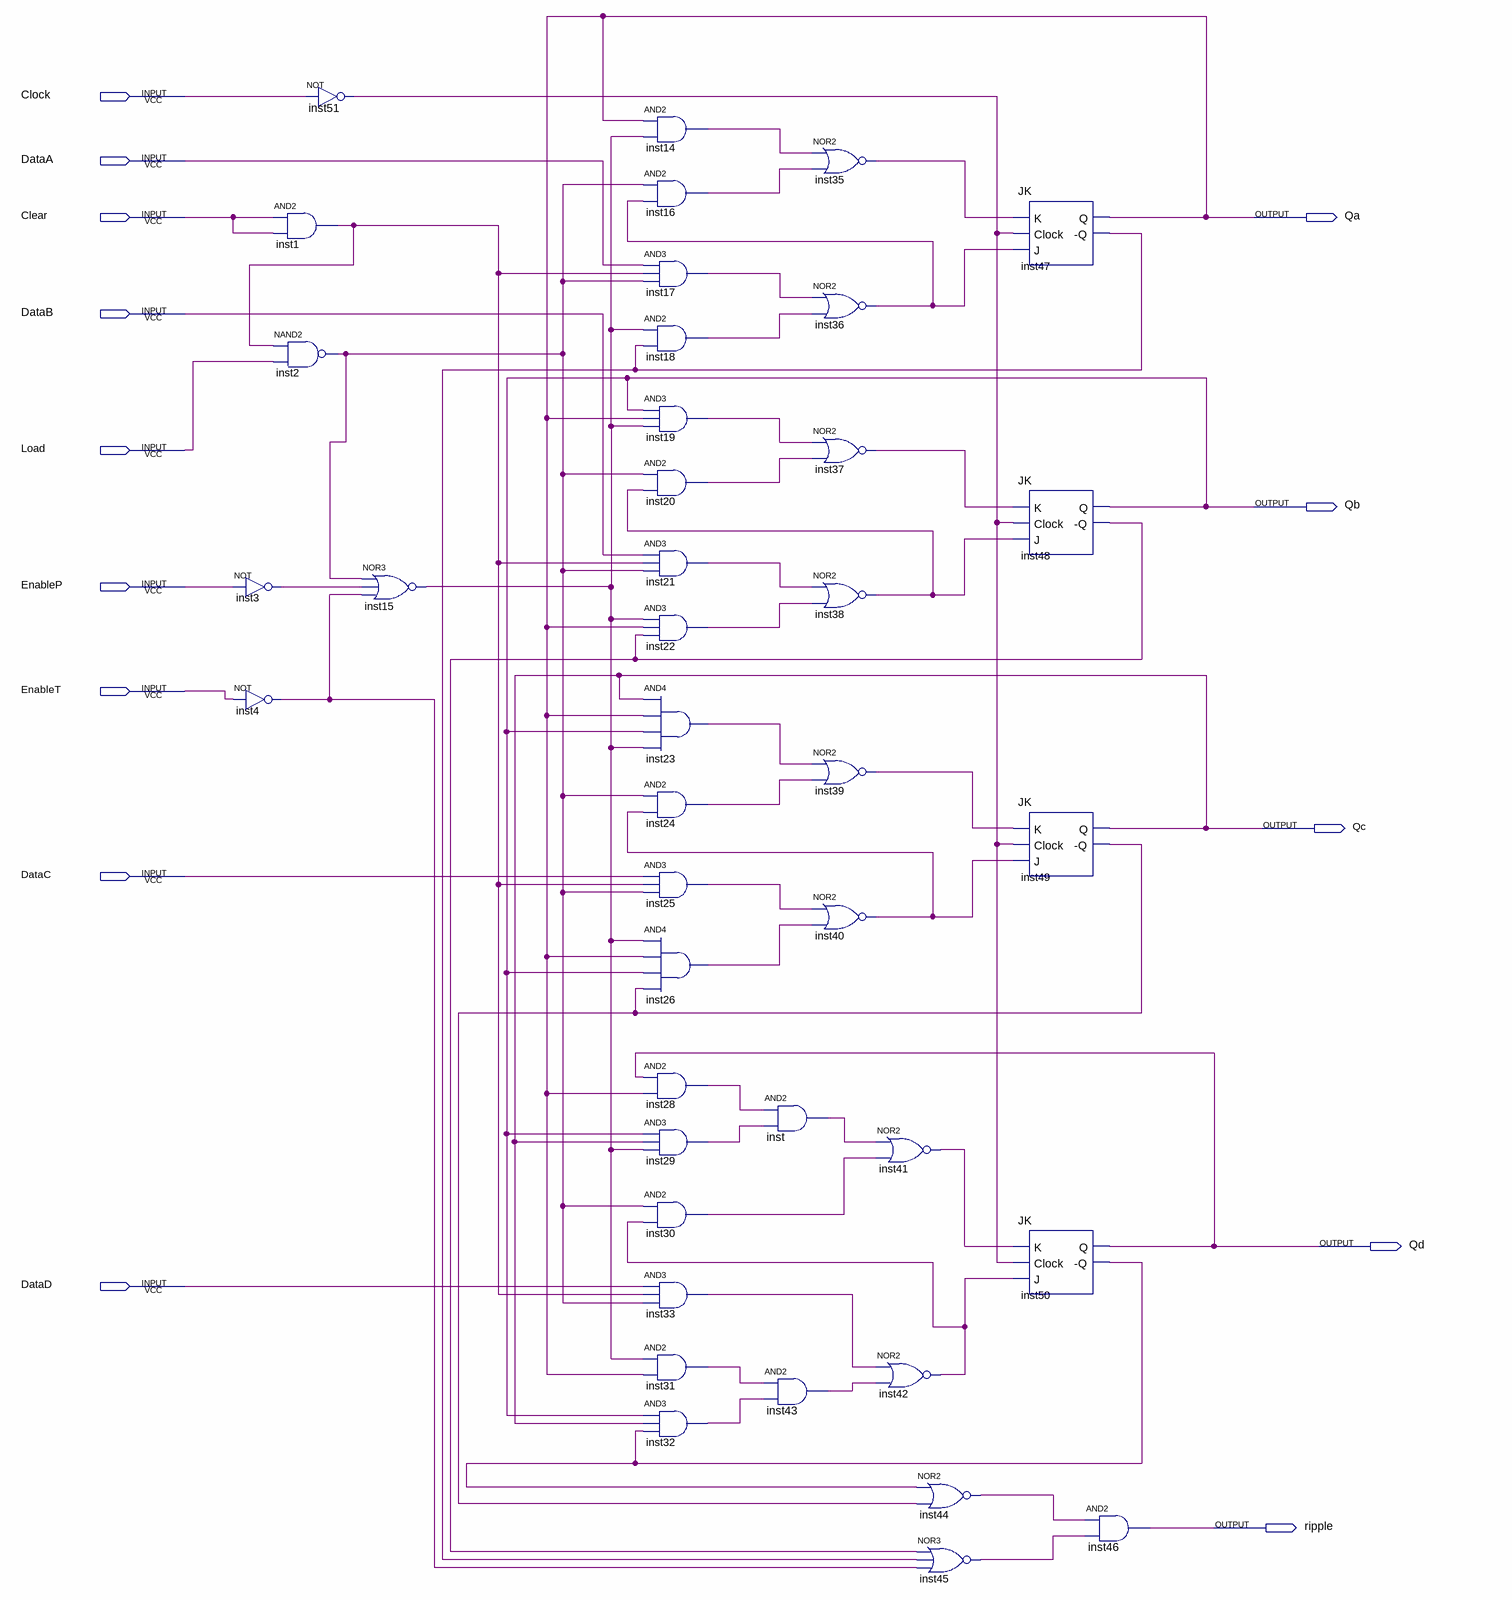
[diagram p0: schematic sheet]
// Quartus schematic 74LS161.bdf as structural Verilog: 41 symbols, 14 pins
module \74LS161  (
  input  Clock,
  input  DataA,
  input  Clear,
  input  DataB,
  input  Load,
  input  EnableP,
  input  EnableT,
  input  DataC,
  input  DataD,
  output Qa,
  output Qb,
  output Qc,
  output Qd,
  output ripple
);

  wire inst1_out, inst2_out, inst3_out, inst4_out, inst14_out, inst15_out, inst16_out, inst17_out,
       inst18_out, inst19_out, inst20_out, inst21_out, inst22_out, inst23_out, inst24_out, inst25_out,
       inst26_out, inst28_out, inst29_out, inst30_out, inst31_out, inst32_out, inst33_out, inst35_out,
       inst36_out, inst37_out, inst38_out, inst39_out, inst40_out, inst41_out, inst42_out, inst43_out,
       inst44_out, inst45_out, inst47__q, inst48__q, inst49__q, inst50__q, inst51_out, inst_out;

  and inst1 (inst1_out, Clear, Clear);
  nand inst2 (inst2_out, inst1_out, Load);
  not inst3 (inst3_out, EnableP);
  not inst4 (inst4_out, EnableT);
  not inst51 (inst51_out, Clock);
  nor inst15 (inst15_out, inst2_out, inst3_out, inst4_out);
  and inst14 (inst14_out, Qa, inst15_out);
  and inst16 (inst16_out, inst2_out, inst36_out);
  and inst17 (inst17_out, DataA, inst1_out, inst2_out);
  and inst18 (inst18_out, inst15_out, inst47__q);
  and inst19 (inst19_out, Qb, Qa, inst15_out);
  and inst20 (inst20_out, inst2_out, inst38_out);
  and inst21 (inst21_out, DataB, inst1_out, inst2_out);
  and inst22 (inst22_out, inst15_out, Qa, inst48__q);
  and inst23 (inst23_out, Qc, Qa, Qb, inst15_out);
  and inst24 (inst24_out, inst2_out, inst40_out);
  and inst25 (inst25_out, DataC, inst1_out, inst2_out);
  and inst26 (inst26_out, inst15_out, Qa, Qb, inst49__q);
  and inst28 (inst28_out, Qd, Qa);
  and inst29 (inst29_out, Qb, Qc, inst15_out);
  and inst30 (inst30_out, inst2_out, inst42_out);
  and inst33 (inst33_out, DataD, inst1_out, inst2_out);
  and inst31 (inst31_out, inst15_out, Qa);
  and inst32 (inst32_out, Qb, Qc, inst50__q);
  and inst (inst_out, inst28_out, inst29_out);
  and inst43 (inst43_out, inst31_out, inst32_out);
  nor inst35 (inst35_out, inst14_out, inst16_out);
  nor inst36 (inst36_out, inst17_out, inst18_out);
  nor inst37 (inst37_out, inst19_out, inst20_out);
  nor inst38 (inst38_out, inst21_out, inst22_out);
  nor inst39 (inst39_out, inst23_out, inst24_out);
  nor inst40 (inst40_out, inst25_out, inst26_out);
  nor inst41 (inst41_out, inst_out, inst30_out);
  nor inst42 (inst42_out, inst33_out, inst43_out);
  nor inst44 (inst44_out, inst50__q, inst49__q);
  nor inst45 (inst45_out, inst48__q, inst47__q, inst4_out);
  JK inst47 (.J(inst36_out), .Clock(inst51_out), .K(inst35_out), .Q(Qa), .\-Q (inst47__q));
  JK inst48 (.J(inst38_out), .Clock(inst51_out), .K(inst37_out), .Q(Qb), .\-Q (inst48__q));
  JK inst49 (.J(inst40_out), .Clock(inst51_out), .K(inst39_out), .Q(Qc), .\-Q (inst49__q));
  JK inst50 (.J(inst42_out), .Clock(inst51_out), .K(inst41_out), .Q(Qd), .\-Q (inst50__q));
  and inst46 (ripple, inst44_out, inst45_out);
endmodule
